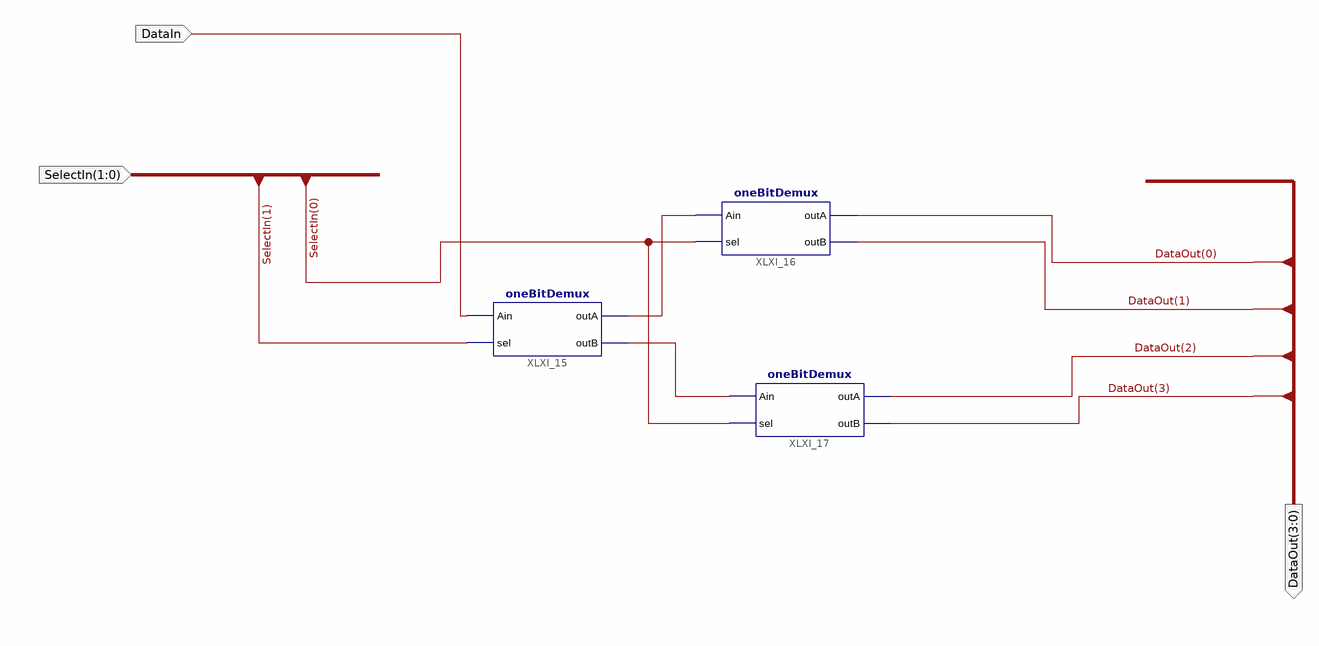
[diagram p0: schematic sheet 1]
// Xilinx ISE schematic demux4.sch (spartan3e) as structural Verilog: 3 symbols, 3 ports
module demux4 (
  input  DataIn,
  input  [1:0] SelectIn,
  output [3:0] DataOut
);

  wire XLXN_18, XLXN_19;

  oneBitDemux XLXI_15 (.Ain(DataIn), .sel(SelectIn[1]), .outA(XLXN_18), .outB(XLXN_19));
  oneBitDemux XLXI_16 (.Ain(XLXN_18), .sel(SelectIn[0]), .outA(DataOut[0]), .outB(DataOut[1]));
  oneBitDemux XLXI_17 (.Ain(XLXN_19), .sel(SelectIn[0]), .outA(DataOut[2]), .outB(DataOut[3]));
endmodule
